# EAGLE design MagnetAdapter (EAGLE 9.6.2)
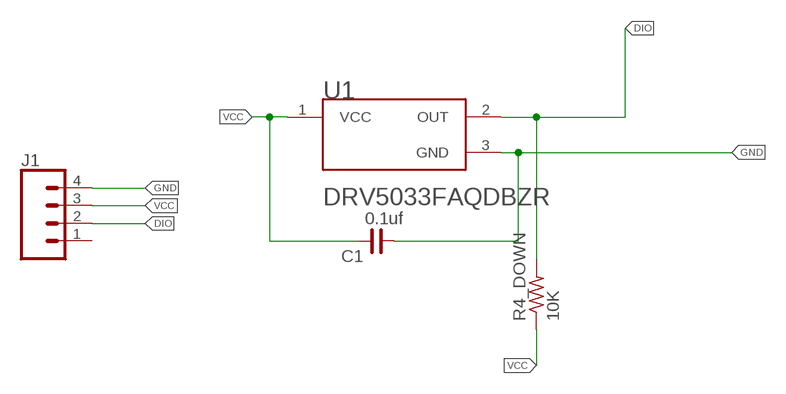
[diagram p0: schematic, sheet 1]

## Parts
C1  0.1uf  C_0805  [C0805]
J1  CONN_041X04_NO_SILK  [1X04_NO_SILK]
R4_DOWN  10K  R-US_M0805  [M0805]
U1  TEXAS_INSTRUMENTS_DRV5033FAQDBZRTEXAS_INSTRUMENTS_DRV5033FAQDBZR_0_0  [TEXAS_INSTRUMENTS_DRV5033FAQDBZR_0]

## Nets
DIO: J1.2 R4_DOWN.2 U1.2(OUT)
GND: C1.1 J1.4 U1.3(GND)
VCC: C1.2 J1.3 R4_DOWN.1 U1.1(VCC)
Unconnected: J1.1

## Library data of the parts
C1 = rc-master-smd:C_: NON-POLARIZED CAP
J1 = SparkFun-Connectors:CONN_04: Multi connection point. Often used as Generic Header-pin footprint for 0.1 inch spaced/style header connections On any of the 0.1 inch spaced packages, you can populate with these: Break Away Headers - Straight <https://www.sparkfun.com/products/116> (PRT-00116) Break Away Male Headers - Right Angle <https://www.sparkfun.com/products/553> (PRT-00553) Female Headers <https://www.sparkfun.com/products/115> (PRT-00115) Break Away Headers - Machine Pin <https://www.sparkfun.com/products/117> (PRT-00117) Break Away Female Headers - Swiss Machine Pin <https://www.sparkfun.com/products/743> (PRT-00743) For SCREWTERMINALS and SPRING TERMINALS visit here: Screw Terimnals on SparkFun.com <https://www.sparkfun.com/search/results?term=Screw+Terminals> (5mm/3.5mm/2.54mm spacing) This device is also useful as a general connection point to wire up your design to another part of your project. Our various solder wires solder well into these plated through hole pads. Hook-Up Wire - Assortment (Stranded, 22 AWG) <https://www.sparkfun.com/products/11375> (PRT-11375) Hook-Up Wire - Assortment (Solid Core, 22 AWG) <https://www.sparkfun.com/products/11367> (PRT-11367) View the entire wire category on our website here <https://www.sparkfun.com/categories/141> Special notes: Molex polarized connector foot print use with SKU : PRT-08231 with associated crimp pins and housings. 1MM SMD Version SKU: PRT-10208; PROD_ID: CONN-09696
R4_DOWN = resistor:R-US_: RESISTOR, American symbol
U1 = Texas Instruments - DRV5033FAQDBZR:TEXAS_INSTRUMENTS_DRV5033FAQDBZR: Digital Switch Omnipolar Switch Open Drain Hall Effect SOT-23-3; AMBIENT_TEMPERATURE_RANGE_HIGH: +125°C; AMBIENT_TEMPERATURE_RANGE_LOW: -40°C; AUTOMOTIVE: No; CENTROID_NOT_SPECIFIED: No; DATASHEET: https://www.ti.com/lit/gpn/DRV5033; DEVICE_CLASS_L1: Sensors; DEVICE_CLASS_L2: Magnetic Sensors; DEVICE_CLASS_L3: unset; DIGIKEY_DESCRIPTION: MAGNETIC SWITCH OMNIPOL SOT23-3; DIGIKEY_PART_NUMBER: 296-44589-1-ND; FOOTPRINT_PARAMETERS_1: {"fp_type":"SOT23","params":{"N":{"default":"3","long name":"Number of leads","type":"multichoice","short name":"N"},"A":{"nom":false,"long name":"Height","min":false,"max":1120000,"short name":"A","type":"measurement"},"A1":{"nom":false,"long name":"Package clearance","min":10000,"max":100000,"short name":"A1","type":"measurement"},"A2":{"nom":950000,"long name":"Package height","min":false,"max":false,"short name":"A2","type":"measurement"},"D":{"nom":false,"long name":"Package length","min":2800000,"max":3040000,"short name":"D","type":"measurement"},"E":{"nom":false,"long name":"Width /w leads","min":2100000,"max":2640000,"short name":"E","type":"measurement"},"E1":{"nom":false,"long name":"Package width","min":1200000,"max":1400000,"short name":"E1","type":"measurement"},"B":{"nom":false,"long name":"Lead width","min":300000,"max":500000,"short name":"B","type":"measurement"},"C":{"nom":false,"long name":"Lead thickness","min":80000,"max":200000,"short name":"C","type":"measurement"},"L":{"nom":false,"long name":"Lead foot length","min":200000,"max":600000,"short name":"L","type":"measurement"},"e":{"nom":950000,"long name":"Lead pitch","min":null,"max":null,"short name":"e","type":"measurement"},"PHI":{"nom":false,"long name":"Lead angle","min":0,"max":8000000,"short name":"PHI","type":"measurement"},"offset x":{"nom":0,"long name":"X Center offset","min":null,"max":null,"short name":"offset x","type":"measurement"},"offset y":{"nom":0,"long name":"Y Center offset","min":null,"max":null,"short name":"offset y","type":"measurement"},"LS":{"default":"Rounded rectangle","long name":"Land shape","type":"multichoice","short name":"LS"},"LS1":{"default":"Rectangle","long name":"Land shape (Pin 1)","type":"multichoice","short name":"LS1"},"solder toe":{"nom":550000,"long name":"Solder fillet (toe)","min":null,"max":null,"short name":"solder toe","type":"fixedmeasurement"},"solder heel":{"nom":450000,"long name":"Solder fillet (heel)","min":null,"max":null,"short name":"solder heel","type":"fixedmeasurement"},"solder side":{"nom":50000,"long name":"Solder fillet (side)","min":null,"max":null,"short name":"solder side","type":"fixedmeasurement"},"courtyard":{"nom":500000,"long name":"Courtyard","min":null,"max":null,"short name":"courtyard","type":"fixedmeasurement"},"SF":{"default":"A","long name":"Packing level","type":"multichoiceparent","short name":"SF","help":"http://support.upverter.com/customer/portal/articles/978783-what-is-a-footprint-packing-level","children":["solder toe","solder heel","solder side","courtyard"]}}}; FOOTPRINT_PARAMETERS_2: {"fp_type":"SOT23","params":{"N":{"default":"3","long name":"Number of leads","type":"multichoice","short name":"N"},"A":{"nom":false,"long name":"Height","min":false,"max":1120000,"short name":"A","type":"measurement"},"A1":{"nom":false,"long name":"Package clearance","min":10000,"max":100000,"short name":"A1","type":"measurement"},"A2":{"nom":950000,"long name":"Package height","min":false,"max":false,"short name":"A2","type":"measurement"},"D":{"nom":false,"long name":"Package length","min":2800000,"max":3040000,"short name":"D","type":"measurement"},"E":{"nom":false,"long name":"Width /w leads","min":2100000,"max":2640000,"short name":"E","type":"measurement"},"E1":{"nom":false,"long name":"Package width","min":1200000,"max":1400000,"short name":"E1","type":"measurement"},"B":{"nom":false,"long name":"Lead width","min":300000,"max":500000,"short name":"B","type":"measurement"},"C":{"nom":false,"long name":"Lead thickness","min":80000,"max":200000,"short name":"C","type":"measurement"},"L":{"nom":false,"long name":"Lead foot length","min":200000,"max":600000,"short name":"L","type":"measurement"},"e":{"nom":950000,"long name":"Lead pitch","min":null,"max":null,"short name":"e","type":"measurement"},"PHI":{"nom":false,"long name":"Lead angle","min":0,"max":8000000,"short name":"PHI","type":"measurement"},"offset x":{"nom":0,"long name":"X Center offset","min":null,"max":null,"short name":"offset x","type":"measurement"},"offset y":{"nom":0,"long name":"Y Center offset","min":null,"max":null,"short name":"offset y","type":"measurement"},"LS":{"default":"Rounded rectangle","long name":"Land shape","type":"multichoice","short name":"LS"},"LS1":{"default":"Rectangle","long name":"Land shape (Pin 1)","type":"multichoice","short name":"LS1"},"solder toe":{"nom":350000,"long name":"Solder fillet (toe)","min":null,"max":null,"short name":"solder toe","type":"fixedmeasurement"},"solder heel":{"nom":350000,"long name":"Solder fillet (heel)","min":null,"max":null,"short name":"solder heel","type":"fixedmeasurement"},"solder side":{"nom":30000,"long name":"Solder fillet (side)","min":null,"max":null,"short name":"solder side","type":"fixedmeasurement"},"courtyard":{"nom":250000,"long name":"Courtyard","min":null,"max":null,"short name":"courtyard","type":"fixedmeasurement"},"SF":{"default":"B","long name":"Packing level","type":"multichoiceparent","short name":"SF","help":"http://support.upverter.com/customer/portal/articles/978783-what-is-a-footprint-packing-level","children":["solder toe","solder heel","solder side","courtyard"]}}}; FOOTPRINT_PARAMETERS_3: {"fp_type":"SOT23","params":{"N":{"default":"3","long name":"Number of leads","type":"multichoice","short name":"N"},"A":{"nom":false,"long name":"Height","min":false,"max":1120000,"short name":"A","type":"measurement"},"A1":{"nom":false,"long name":"Package clearance","min":10000,"max":100000,"short name":"A1","type":"measurement"},"A2":{"nom":950000,"long name":"Package height","min":false,"max":false,"short name":"A2","type":"measurement"},"D":{"nom":false,"long name":"Package length","min":2800000,"max":3040000,"short name":"D","type":"measurement"},"E":{"nom":false,"long name":"Width /w leads","min":2100000,"max":2640000,"short name":"E","type":"measurement"},"E1":{"nom":false,"long name":"Package width","min":1200000,"max":1400000,"short name":"E1","type":"measurement"},"B":{"nom":false,"long name":"Lead width","min":300000,"max":500000,"short name":"B","type":"measurement"},"C":{"nom":false,"long name":"Lead thickness","min":80000,"max":200000,"short name":"C","type":"measurement"},"L":{"nom":false,"long name":"Lead foot length","min":200000,"max":600000,"short name":"L","type":"measurement"},"e":{"nom":950000,"long name":"Lead pitch","min":null,"max":null,"short name":"e","type":"measurement"},"PHI":{"nom":false,"long name":"Lead angle","min":0,"max":8000000,"short name":"PHI","type":"measurement"},"offset x":{"nom":0,"long name":"X Center offset","min":null,"max":null,"short name":"offset x","type":"measurement"},"offset y":{"nom":0,"long name":"Y Center offset","min":null,"max":null,"short name":"offset y","type":"measurement"},"LS":{"default":"Rounded rectangle","long name":"Land shape","type":"multichoice","short name":"LS"},"LS1":{"default":"Rectangle","long name":"Land shape (Pin 1)","type":"multichoice","short name":"LS1"},"solder toe":{"nom":150000,"long name":"Solder fillet (toe)","min":null,"max":null,"short name":"solder toe","type":"fixedmeasurement"},"solder heel":{"nom":250000,"long name":"Solder fillet (heel)","min":null,"max":null,"short name":"solder heel","type":"fixedmeasurement"},"solder side":{"nom":10000,"long name":"Solder fillet (side)","min":null,"max":null,"short name":"solder side","type":"fixedmeasurement"},"courtyard":{"nom":100000,"long name":"Courtyard","min":null,"max":null,"short name":"courtyard","type":"fixedmeasurement"},"SF":{"default":"C","long name":"Packing level","type":"multichoiceparent","short name":"SF","help":"http://support.upverter.com/customer/portal/articles/978783-what-is-a-footprint-packing-level","children":["solder toe","solder heel","solder side","courtyard"]}}}; FOOTPRINT_VARIANT_NAME_0: Recommended_Land_Pattern; FOOTPRINT_VARIANT_NAME_1: IPC_A; FOOTPRINT_VARIANT_NAME_2: IPC_B; FOOTPRINT_VARIANT_NAME_3: IPC_C; HEIGHT: 1.12mm; LEAD_FREE: Yes; MAX_JUNCTION_TEMP: +150°C; MAX_SUPPLY_VOLTAGE: 38V; MF: Texas Instruments; MFG_PACKAGE_IDENT: DBZ0003A; MFG_PACKAGE_IDENT_COMPONENT_ID: 9486d0fa5c97c3d3; MFG_PACKAGE_IDENT_DATE: 0; MFG_PACKAGE_IDENT_REV: 0; MIN_SUPPLY_VOLTAGE: 2.5V; MOUSER_DESCRIPTION: High voltage (up to 38V), high bandwidth (up to 30 kHz) omnipolar switch 3-SOT-23 -40 to 125; MOUSER_PART_NUMBER: 595-DRV5033FAQDBZR; MPN: DRV5033FAQDBZR; OPERATING_SUPPLY_CURRENT: 2.7-3mA; OUTPUT_CURRENT: 30mA; OUTPUT_VOLTAGE: 38V; PACKAGE: SOT23-3; PREFIX: U; ROHS: Yes; SENSING_METHOD: Hall Effect; STANDOFF_HEIGHT: 0.01mm; TEMPERATURE_RANGE_HIGH: +125°C; TEMPERATURE_RANGE_LOW: -40°C; VERIFICATION_VERSION: 0.0.0.3

## Net classes
0 default: width 0.2 mm, clearance 0.2 mm

## Board
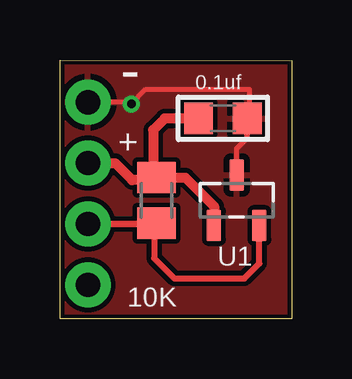
[diagram p1: board, top side]
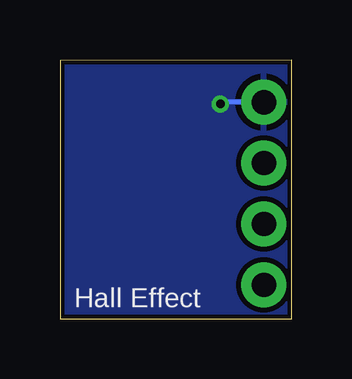
[diagram p2: board, bottom side, seen from below]

Size 9.66 x 10.81 mm. Coordinates in mm from the lower left corner, seen from the top.
Outline: 9.66,10.78 9.66,0 0,0.01 0.01,10.81 9.66,10.78
Copper layers (1*16): Top 0.035mm / dielectric 1.5mm / Bottom 0.035mm
Design rules "SparkFun-2-Layer-General-JLCPCB": minimum track width 7mil, minimum drill 0.3mm, track to track 7mil, track to pad 7mil, pad to pad 7mil, via to via 7mil, smd to smd 7mil, copper to edge 7mil, drill to drill 7mil, minimum pad ring 7mil, minimum via ring 7mil, stop-mask expansion 3mil, vias tented up to drill 25mil, thermal gap 10mil

### Footprints (pad centres in the part's own frame; a part is rotated, then mirrored left to right if it is on the bottom)
C0805 = smd 1.2 x 1.3: 1 -1.016,0; 2 1.016,0
1X04_NO_SILK = drill 1.016 pad 1.88: 1 0,0; 2 2.54,0; 3 5.08,0; 4 7.62,0
M0805 = smd 1.3 x 1.6: 1 -0.95,0; 2 0.95,0
TEXAS_INSTRUMENTS_DRV5033FAQDBZR_0 = smd 1.3 x 0.6: 1 -1.05,0.95; 2 -1.05,-0.95; 3 1.05,0

### Placement (x,y rotation side)
C1  6.79,8.37 180 top
J1  1.17,1.42 90 top
R4_DOWN  4.02,4.95 270 top
U1  7.36,4.95 90 top

### Tracks (layer width: path | path; a pad name or v marks a point on that pad's centre or on a via)
DIO
  Top 0.2: R4_DOWN.2 3.93,3.9
  Top 0.203: R4_DOWN.2 4.17,3.84 | 8.31,3.62 U1.2
  Top 0.254: 3.93,3.9 3.93,2.53 4.77,1.69 7.69,1.69 8.31,2.31 8.31,3.62 | R4_DOWN.2 3.99,3.96 J1.2 4.05,3.96 4.17,3.84 4.17,3.94 4.08,3.94 R4_DOWN.2
GND  (via drill 0.35)
  Top 0.203: U1.3 7.36,7.12 7.78,7.54 7.78,8.34 C1.1 7.89,8.45 7.89,9.57 7.88,9.58 3.58,9.58 v2.97,8.97 2.9,9.04 1.46,9.04 1.45,9.04 J1.4
  Bottom 0.2: J1.4 2.9,9.04 v2.97,8.97
  pour Top (isolate 0.005): -0.3,10.83 10.12,10.83 10.12,-0.16 -0.3,-0.16
  pour Bottom (isolate 0.005): 10.08,11.18 10.08,-0.13 -0.48,-0.13 -0.48,11.18
VCC
  Top 0.406: 5.67,8.26 C1.2 4.36,8.37 3.88,7.89 3.88,6.04 R4_DOWN.1 | 1.18,6.5 J1.3 2.3,6.5 3.01,5.8 3.92,5.8 R4_DOWN.1 | R4_DOWN.1 5.23,5.9 6.42,4.7 6.42,3.92 U1.1

### Text on the board
tPlace: - | +
bPlace: Hall Effect